# EAGLE schematic cosmicpifpgaOHL (EAGLE 8.3.1)
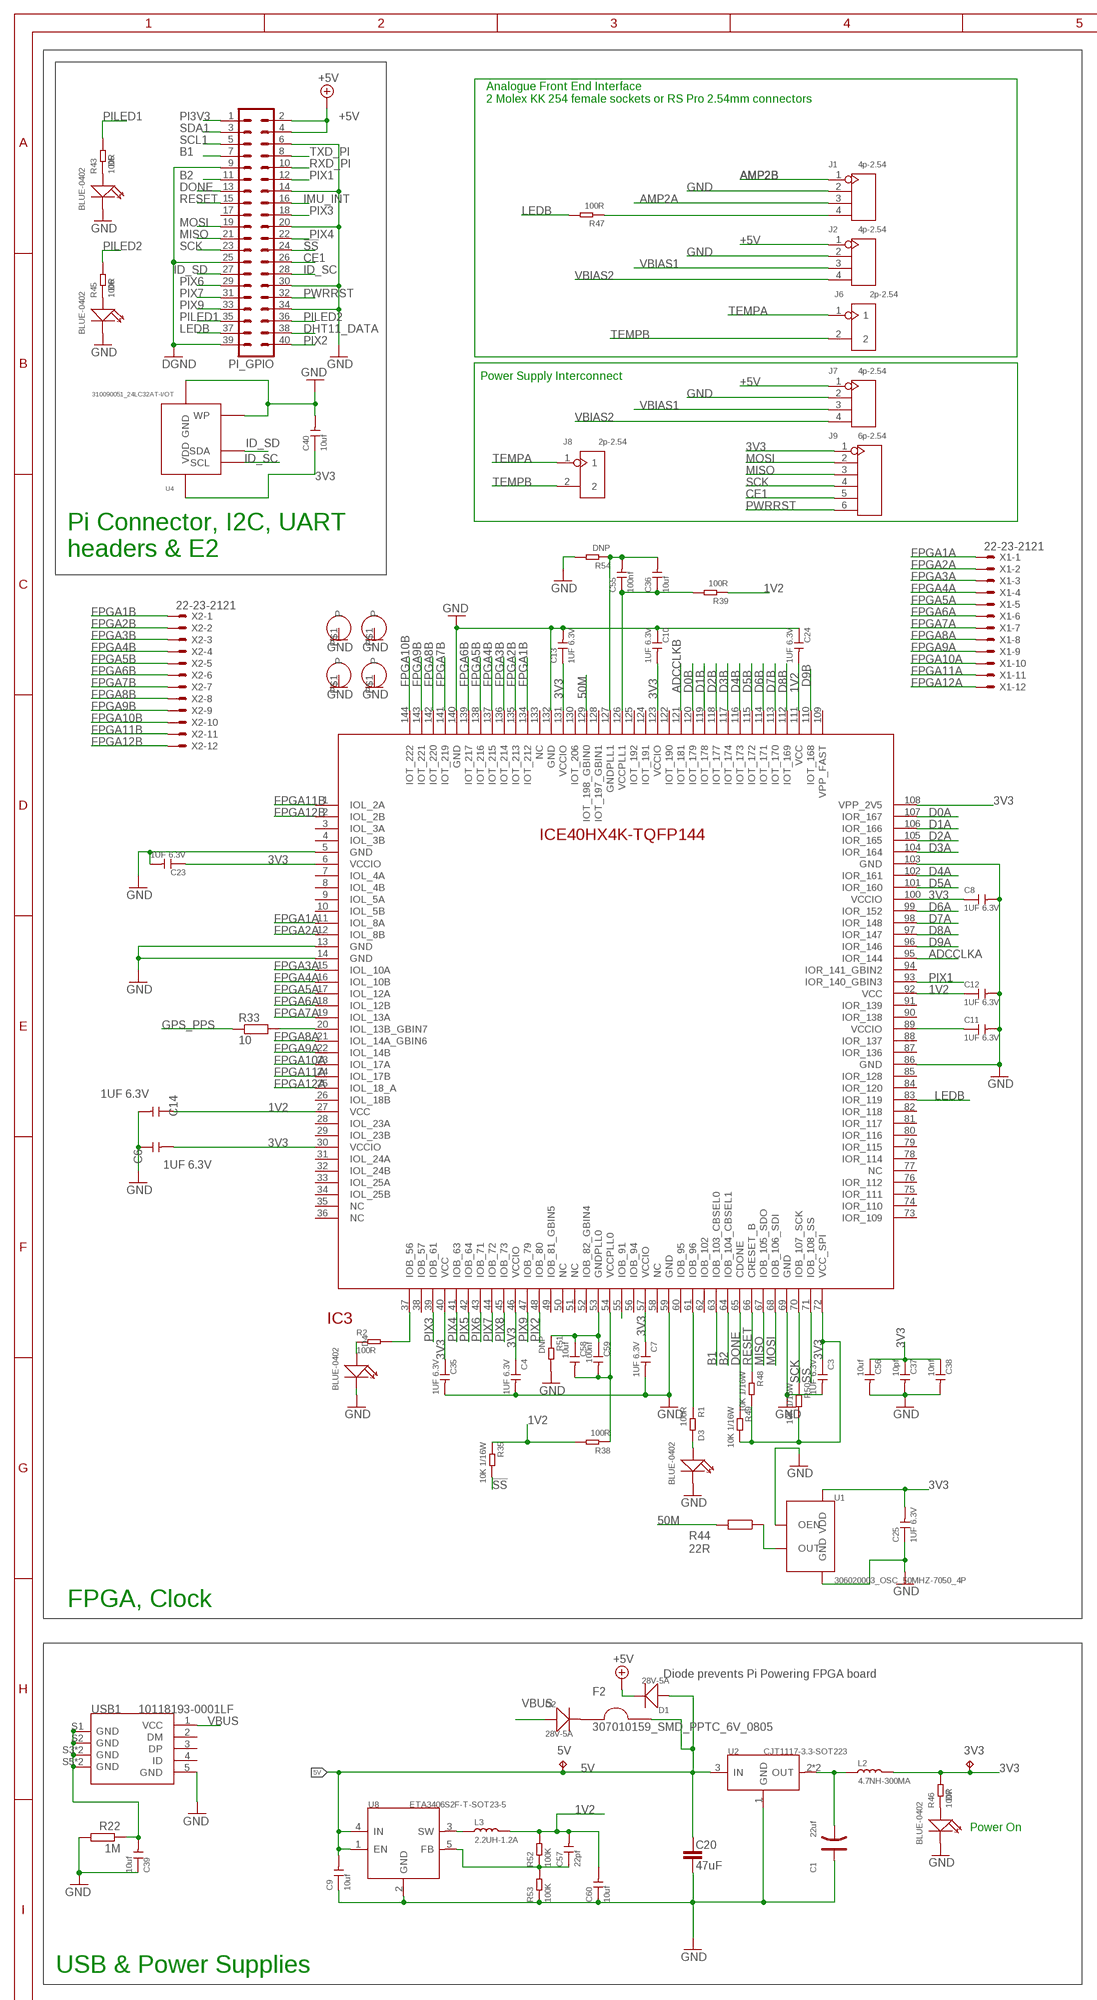
[diagram p0: schematic, sheet 1, part 1 of 2]
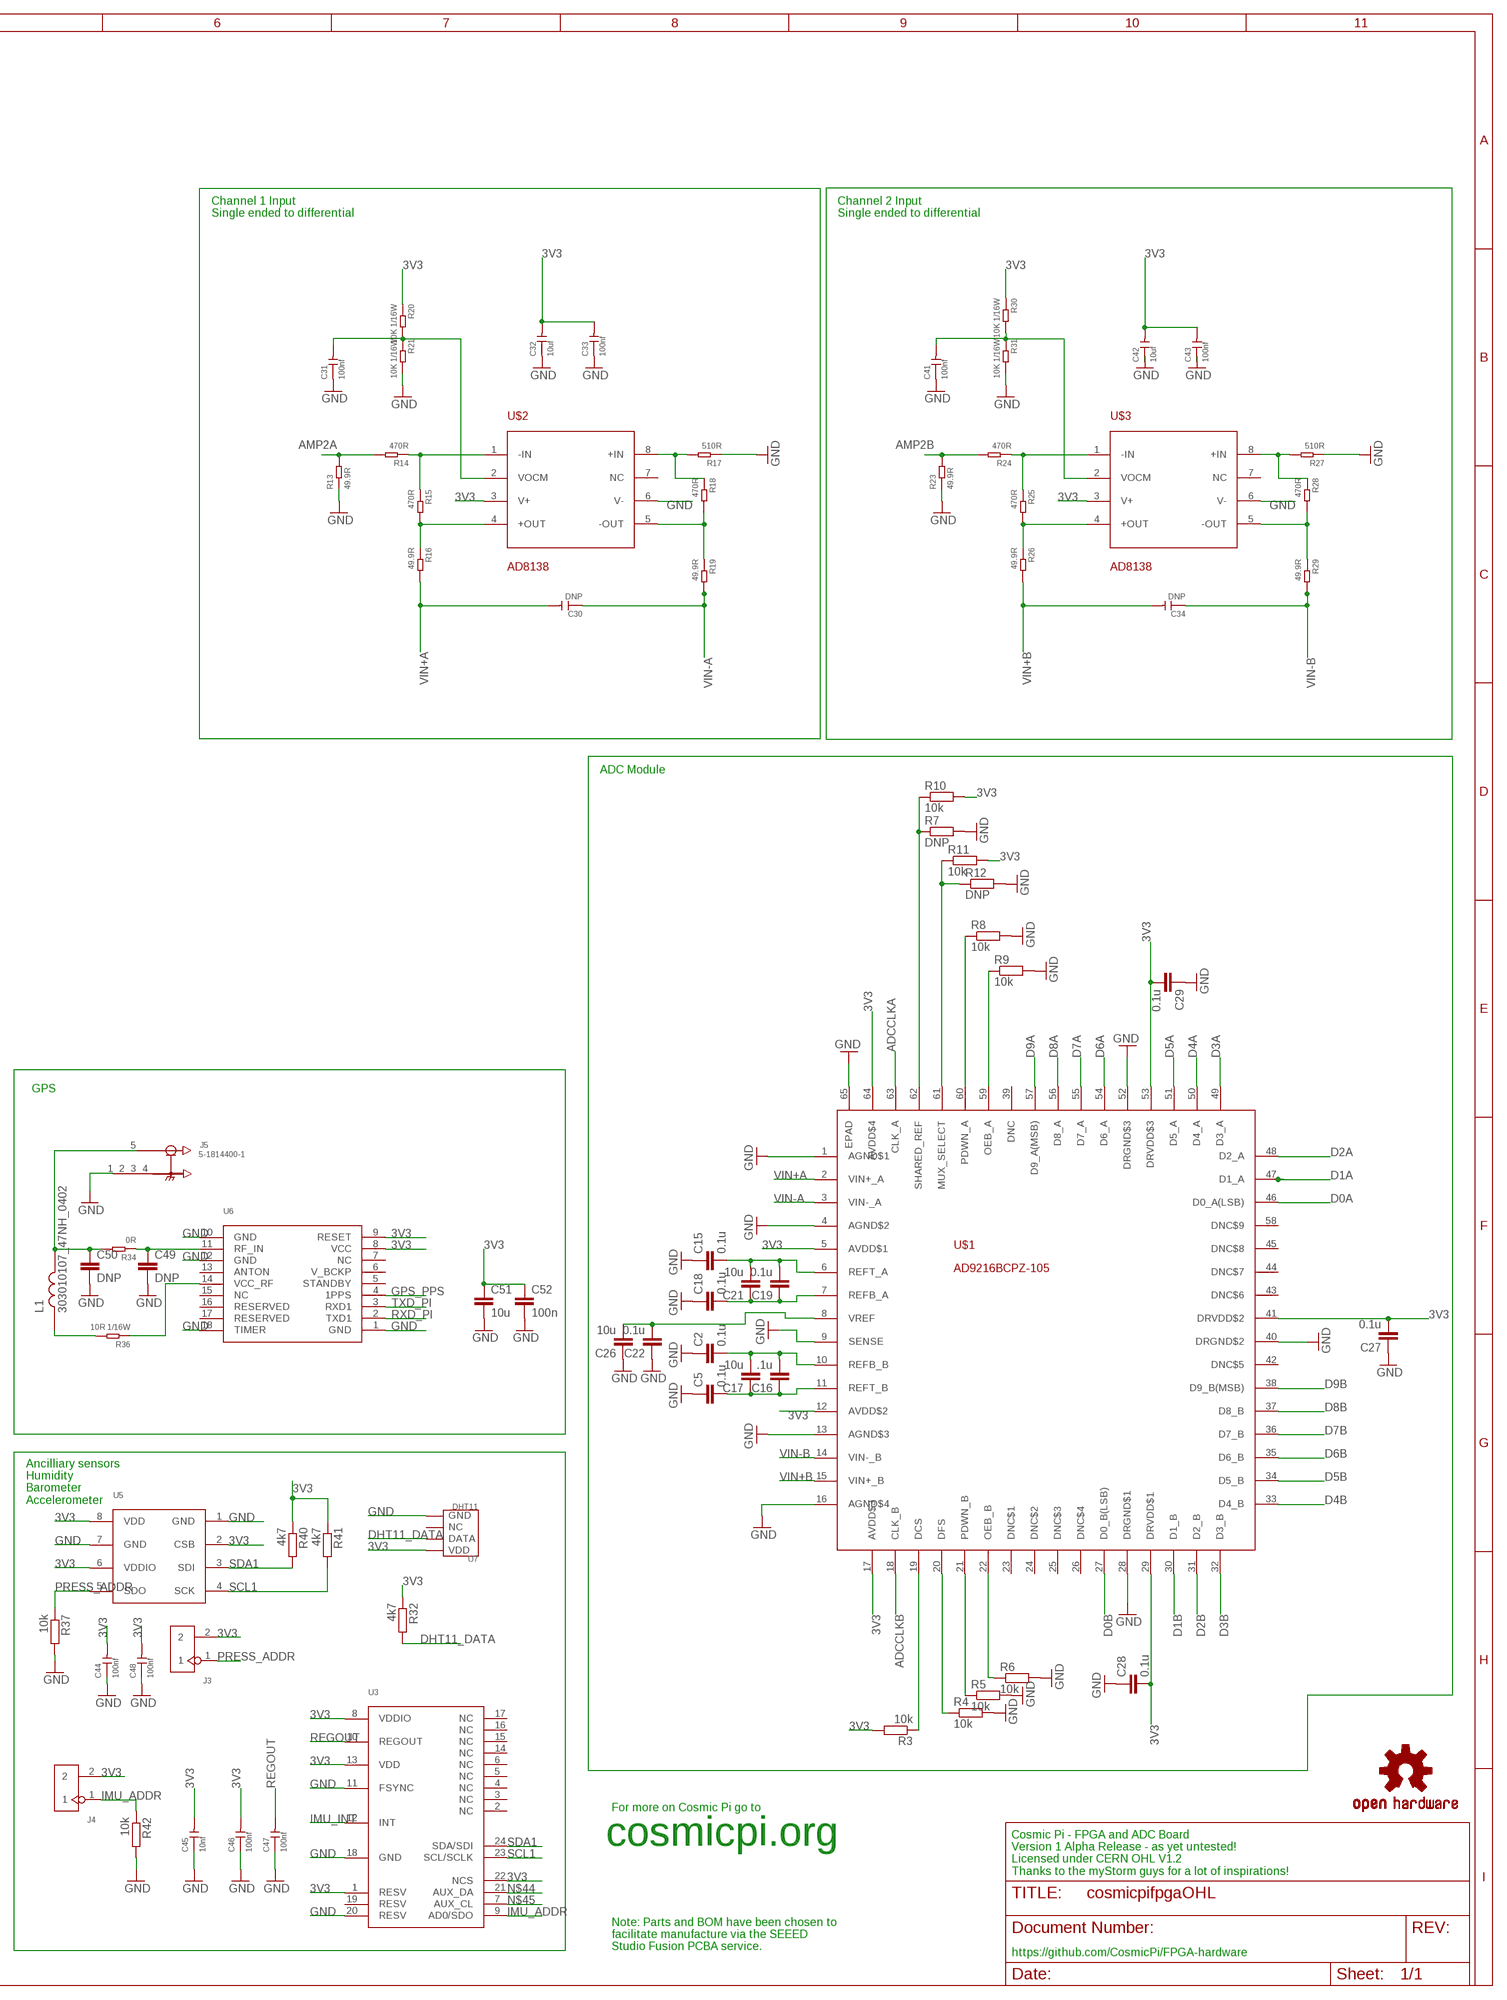
[diagram p1: schematic, sheet 1, part 2 of 2]

## Parts
3V3  TPB1,27  [B1,27]
5V  TPB1,27  [B1,27]
C1  22uf  TANTALUM-SMD-22UF-10V-10%(AVX-B)  [AVX-B]
C2  0.1u  C-EUC0402  [C0402]
C3  1UF 6.3V  CERAMIC-1UF-6.3V-10%-X5R(0402)  [C0402]
C4  1UF 6.3V  CERAMIC-1UF-6.3V-10%-X5R(0402)  [C0402]
C5  0.1u  C-EUC0402  [C0402]
C6  1UF 6.3V  CERAMIC-1UF-6.3V-10%-X5R(0402)  [C0402]
C7  1UF 6.3V  CERAMIC-1UF-6.3V-10%-X5R(0402)  [C0402]
C8  1UF 6.3V  CERAMIC-1UF-6.3V-10%-X5R(0402)  [C0402]
C9  10uf  CERAMIC-10UF-6.3V-20%-X5R(0402)  [C0402]
C10  1UF 6.3V  CERAMIC-1UF-6.3V-10%-X5R(0402)  [C0402]
C11  1UF 6.3V  CERAMIC-1UF-6.3V-10%-X5R(0402)  [C0402]
C12  1UF 6.3V  CERAMIC-1UF-6.3V-10%-X5R(0402)  [C0402]
C13  1UF 6.3V  CERAMIC-1UF-6.3V-10%-X5R(0402)  [C0402]
C14  1UF 6.3V  CERAMIC-1UF-6.3V-10%-X5R(0402)  [C0402]
C15  0.1u  C-EUC0402  [C0402]
C16  .1u  C-EUC0402  [C0402]
C17  10u  C-EUC0402  [C0402]
C18  0.1u  C-EUC0402  [C0402]
C19  0.1u  C-EUC0402  [C0402]
C20  47uF  C_1206  [1206]
C21  10u  C-EUC0402  [C0402]
C22  0.1u  C-EUC0402  [C0402]
C23  1UF 6.3V  CERAMIC-1UF-6.3V-10%-X5R(0402)  [C0402]
C24  1UF 6.3V  CERAMIC-1UF-6.3V-10%-X5R(0402)  [C0402]
C25  1UF 6.3V  CERAMIC-1UF-6.3V-10%-X5R(0402)  [C0402]
C26  10u  C-EUC0402  [C0402]
C27  0.1u  C-EUC0402  [C0402]
C28  0.1u  C-EUC0402  [C0402]
C29  0.1u  C-EUC0402  [C0402]
C30  DNP  CERAMIC-100NF-50V-10%-X7R(0603)  [C0603]
C31  100nf  CERAMIC-100NF-25V-10%-X7R(0402)  [C0402]
C32  10uf  CERAMIC-10UF-6.3V-20%-X5R(0402)  [C0402]
C33  100nf  CERAMIC-100NF-25V-10%-X7R(0402)  [C0402]
C34  DNP  CERAMIC-100NF-50V-10%-X7R(0603)  [C0603]
C35  1UF 6.3V  CERAMIC-1UF-6.3V-10%-X5R(0402)  [C0402]
C36  10uf  CERAMIC-10UF-6.3V-20%-X5R(0402)  [C0402]
C37  10pf  CERAMIC-10PF-50V-5%-NPO(0402)  [C0402]
C38  10nf  CERAMIC-10NF-50V-10%-X7R(0402)  [C0402]
C39  10uf  CERAMIC-10UF-6.3V-20%-X5R(0402)  [C0402]
C40  10uf  CERAMIC-10UF-6.3V-20%-X5R(0402)  [C0402]
C41  100nf  CERAMIC-100NF-25V-10%-X7R(0402)  [C0402]
C42  10uf  CERAMIC-10UF-6.3V-20%-X5R(0402)  [C0402]
C43  100nf  CERAMIC-100NF-25V-10%-X7R(0402)  [C0402]
C44  100nf  CERAMIC-100NF-25V-10%-X7R(0402)  [C0402]
C45  10nf  CERAMIC-10NF-50V-10%-X7R(0402)  [C0402]
C46  100nf  CERAMIC-100NF-25V-10%-X7R(0402)  [C0402]
C47  100nf  CERAMIC-100NF-25V-10%-X7R(0402)  [C0402]
C48  100nf  CERAMIC-100NF-25V-10%-X7R(0402)  [C0402]
C49  DNP  C-EUC0402  [C0402]
C50  DNP  C-EUC0402  [C0402]
C51  10u  C-EUC0402  [C0402]
C52  100n  C-EUC0402  [C0402]
C55  100nf  CERAMIC-100NF-25V-10%-X7R(0402)  [C0402]
C56  10uf  CERAMIC-10UF-6.3V-20%-X5R(0402)  [C0402]
C57  22pf  CERAMIC-22PF-50V-5%-NPO(0402)  [C0402]
C58  10uf  CERAMIC-10UF-6.3V-20%-X5R(0402)  [C0402]
C59  100nf  CERAMIC-100NF-25V-10%-X7R(0402)  [C0402]
C60  10uf  CERAMIC-10UF-6.3V-20%-X5R(0402)  [C0402]
D1  28V-5A  SMD-DIODE-SCHOTTKY-28V-5A(DO-214AA)  [DO-214AA]
D2  28V-5A  SMD-DIODE-SCHOTTKY-28V-5A(DO-214AA)  [DO-214AA]
D3  BLUE-0402  SMD-LED-CLEAR-BLUE(0402)  [LED-0402]
D4  BLUE-0402  SMD-LED-CLEAR-BLUE(0402)  [LED-0402]
D5  BLUE-0402  SMD-LED-CLEAR-BLUE(0402)  [LED-0402]
D6  BLUE-0402  SMD-LED-CLEAR-BLUE(0402)  [LED-0402]
D7  BLUE-0402  SMD-LED-CLEAR-BLUE(0402)  [LED-0402]
F2  307010159_SMD_PPTC_6V_0805  [F0805]
IC3  ICE40HX4K_TQFP144  [TQFP144]
J1  4p-2.54  DIP-BLACK-FEMALE-HEADER-VERT(4P-2.54)  [H4-2.54]
J2  4p-2.54  DIP-BLACK-FEMALE-HEADER-VERT(4P-2.54)  [H4-2.54]
J3  DIP-BLACK-JUMPER  [H2-2.54]
J4  DIP-BLACK-JUMPER  [H2-2.54]
J5  5-1814400-1  [TE_5-1814400-1]
J6  2p-2.54  DIP-BLACK-MALE-HEADER-VERT(2P-2.54)  [H2-2.54]
J7  4p-2.54  DIP-BLACK-FEMALE-HEADER-VERT(4P-2.54)  [H4-2.54]
J8  2p-2.54  DIP-BLACK-MALE-HEADER-VERT(2P-2.54)  [H2-2.54]
J9  6p-2.54  DIP-LONG-BLACK-FEMALE-HEADER-VERT(6P-2.54)  [H6-2.54]
L1  303010107_47NH_0402  [L0402]
L2  4.7NH-300MA  SMD-INDUCTOR-4.7NH-0.3NH-300MA(0402)  [L0402]
L3  2.2UH-1.2A  SMD-INDUCTOR-2.2UH-20%-1.2A(0805)  [L0805]
OSHW  OSHW-LOGOL  [OSHW-LOGO-L]
PI_GPIO  MA20-2  [MA20-2]
R1  100R  SMD-RES-100R-5%-1/16W(0402)  [R0402]
R2  100R  SMD-RES-100R-5%-1/16W(0402)  [R0402]
R3  10k  R-EU_R0402  [R0402]
R4  10k  R-EU_R0402  [R0402]
R5  10k  R-EU_R0402  [R0402]
R6  10k  R-EU_R0402  [R0402]
R7  DNP  R-EU_R0402  [R0402]
R8  10k  R-EU_R0402  [R0402]
R9  10k  R-EU_R0402  [R0402]
R10  10k  R-EU_R0402  [R0402]
R11  10k  R-EU_R0402  [R0402]
R12  DNP  R-EU_R0402  [R0402]
R13  49.9R  SMD-RES-49.9R-1%-1/10W(0603)  [R0603]
R14  470R  SMD-RES-470R-5%-1/10W(0603)  [R0603]
R15  470R  SMD-RES-470R-5%-1/10W(0603)  [R0603]
R16  49.9R  SMD-RES-49.9R-1%-1/10W(0603)  [R0603]
R17  510R  SMD-RES-510R-5%-1/10W(0603)  [R0603]
R18  470R  SMD-RES-470R-5%-1/10W(0603)  [R0603]
R19  49.9R  SMD-RES-49.9R-1%-1/10W(0603)  [R0603]
R20  10K 1/16W  SMD-RES-10K-1%-1/16W(0402)  [R0402]
R21  10K 1/16W  SMD-RES-10K-1%-1/16W(0402)  [R0402]
R22  1M  R-EU_R0402  [R0402]
R23  49.9R  SMD-RES-49.9R-1%-1/10W(0603)  [R0603]
R24  470R  SMD-RES-470R-5%-1/10W(0603)  [R0603]
R25  470R  SMD-RES-470R-5%-1/10W(0603)  [R0603]
R26  49.9R  SMD-RES-49.9R-1%-1/10W(0603)  [R0603]
R27  510R  SMD-RES-510R-5%-1/10W(0603)  [R0603]
R28  470R  SMD-RES-470R-5%-1/10W(0603)  [R0603]
R29  49.9R  SMD-RES-49.9R-1%-1/10W(0603)  [R0603]
R30  10K 1/16W  SMD-RES-10K-1%-1/16W(0402)  [R0402]
R31  10K 1/16W  SMD-RES-10K-1%-1/16W(0402)  [R0402]
R32  4k7  R-EU_R0402  [R0402]
R33  10  R-EU_R0402  [R0402]
R34  0R  SMD-RES-0R-5%-1/16W(0402)  [R0402]
R35  10K 1/16W  SMD-RES-10K-1%-1/16W(0402)  [R0402]
R36  10R 1/16W  SMD-RES-10R-1%-1/16W(0402)  [R0402]
R37  10k  R-EU_R0402  [R0402]
R38  100R  SMD-RES-100R-5%-1/16W(0402)  [R0402]
R39  100R  SMD-RES-100R-5%-1/16W(0402)  [R0402]
R40  4k7  R-EU_R0402  [R0402]
R41  4k7  R-EU_R0402  [R0402]
R42  10k  R-EU_R0402  [R0402]
R43  100R  SMD-RES-100R-5%-1/16W(0402)  [R0402]
R44  22R  R-EU_R0402  [R0402]
R45  100R  SMD-RES-100R-5%-1/16W(0402)  [R0402]
R46  100R  SMD-RES-100R-5%-1/16W(0402)  [R0402]
R47  100R  SMD-RES-100R-5%-1/16W(0402)  [R0402]
R48  10K 1/16W  SMD-RES-10K-1%-1/16W(0402)  [R0402]
R49  10K 1/16W  SMD-RES-10K-1%-1/16W(0402)  [R0402]
R50  10K 1/16W  SMD-RES-10K-1%-1/16W(0402)  [R0402]
R51  DNP  SMD-RES-100R-5%-1/16W(0402)  [R0402]
R52  100K  SMD-RES-100K-1%-1/16W(0402)  [R0402]
R53  100K  SMD-RES-100K-1%-1/16W(0402)  [R0402]
R54  DNP  SMD-RES-100R-5%-1/16W(0402)  [R0402]
U1  306020003_OSC_50MHZ-7050_4P  [X7050_4P]
U2  CJT1117-3.3-SOT223  PMIC-CJT1117-3.3(SOT223)  [SOT-223]
U3  MPU-9250  [MPU-9250]
U4  310090051_24LC32AT-I/OT  [SOT235]
U5  BMP280  [BMP280]
U6  L70-M39  [L70-M39]
U7  DHT11  TEM-HUM-DHT11(4P-15.5X12.0MM)  [SNR4-2.54-15.5X12.0X5.5MM]
U8  ETA3406S2F-T-SOT23-5  PMIC-DC-DC-ETA3406S2F-T(SOT23-5)  [SOT-23-5]
U$1  AD9216BCPZ-105  [QFN50P900X900X100-65N]
U$2  AD8138  [SOP65P490X110-8N]
U$3  AD8138  [SOP65P490X110-8N]
U$16  HOLE-2.5MM  [2.5MM-HOLE]
U$21  HOLE-2.5MM  [2.5MM-HOLE]
U$22  HOLE-2.5MM  [2.5MM-HOLE]
U$24  HOLE-2.5MM  [2.5MM-HOLE]
USB1  10118193-0001LF  MICRO-USB-SMD-B-(10118193-0001LF)  [MICRO-USB5+6P-SMD-0.65-B]
X1  22-23-2121  [22-23-2121]
X2  22-23-2121  [22-23-2121]

## Nets
1V2: C12.1 C14.1 C24.2 C57.2 C60.2 IC3.27(VCC) IC3.92(VCC) IC3.111(VCC) L3.2 R35.1 R38.2 R39.1 R52.2
3V3: 3V3.TP C3.1 C4.1 C6.2 C7.1 C8.1 C10.2 C13.1 C23.1 C25.2 C27.2 C28.2 C29.2 C32.2 C33.2 C35.1 C37.1 C38.1 C40.1 C42.2 C43.2 C44.2 C45.2 C46.2 C48.2 C51.1 C52.1 C56.1 IC3.6(VCCIO) IC3.30(VCCIO) IC3.40(VCC) IC3.46(VCCIO) IC3.57(VCCIO) IC3.72(VCC_SPI) IC3.100(VCCIO) IC3.108(VPP_2V5) IC3.123(VCCIO) IC3.131(VCCIO) J3.2 J4.2 J9.1 L2.2 R3.2 R10.2 R11.2 R20.1 R30.1 R32.1 R40.1 R41.1 R46.2 R48.2 R49.2 R50.2 U1.P$4(VDD) U3.1(RESV) U3.8(VDDIO) U3.13(VDD) U3.22(NCS) U4.4(VDD) U5.2(CSB) U5.6(VDDIO) U5.8(VDD) U6.8(VCC) U6.9(RESET) U7.1(VDD) U$1.5(AVDD$1) U$1.12(AVDD$2) U$1.17(AVDD$3) U$1.29(DRVDD$1) U$1.41(DRVDD$2) U$1.53(DRVDD$3) U$1.64(AVDD$4) U$2.3(V+) U$3.3(V+)
5V: 5V.TP C9.2 C20.1 D1.+ F2.P$2 U2.3(IN) U8.1(EN) U8.4(IN)
50M: IC3.129(IOT_198_GBIN0) R44.2
!SS: IC3.71(IOB_108_SS) PI_GPIO.24 R35.2
+5V: D1.- J2.1 J7.1 PI_GPIO.2 PI_GPIO.4
ADCCLKA: IC3.95(IOR_144) U$1.63(CLK_A)
ADCCLKB: IC3.121(IOT_181) U$1.18(CLK_B)
AMP2A [timing]: J1.3 R13.2 R14.2
AMP2B [timing]: J1.1 R23.2 R24.2
B1: IC3.63(IOB_103_CBSEL0) PI_GPIO.7
B2: IC3.64(IOB_104_CBSEL1) PI_GPIO.11
CE1: J9.5 PI_GPIO.26
D0A: IC3.107(IOR_167) U$1.46(D0_A(LSB))
D0B: IC3.120(IOT_179) U$1.27(D0_B(LSB))
D1A: IC3.106(IOR_166) U$1.47(D1_A)
D1B: IC3.119(IOT_178) U$1.30(D1_B)
D2A: IC3.105(IOR_165) U$1.48(D2_A)
D2B: IC3.118(IOT_177) U$1.31(D2_B)
D3A: IC3.104(IOR_164) U$1.49(D3_A)
D3B: IC3.117(IOT_174) U$1.32(D3_B)
D4A: IC3.102(IOR_161) U$1.50(D4_A)
D4B: IC3.116(IOT_173) U$1.33(D4_B)
D5A: IC3.101(IOR_160) U$1.51(D5_A)
D5B: IC3.115(IOT_172) U$1.34(D5_B)
D6A: IC3.99(IOR_152) U$1.54(D6_A)
D6B: IC3.114(IOT_171) U$1.35(D6_B)
D7A: IC3.98(IOR_148) U$1.55(D7_A)
D7B: IC3.113(IOT_170) U$1.36(D7_B)
D8A: IC3.97(IOR_147) U$1.56(D8_A)
D8B: IC3.112(IOT_169) U$1.37(D8_B)
D9A: IC3.96(IOR_146) U$1.57(D9_A(MSB))
D9B: IC3.110(IOT_168) U$1.38(D9_B(MSB))
DHT11_DATA: PI_GPIO.38 R32.2 U7.2(DATA)
DONE: IC3.65(CDONE) PI_GPIO.13 R49.1
FPGA1A: IC3.11(IOL_8A) X1.1
FPGA1B: IC3.134(IOT_212) X2.1
FPGA2A: IC3.12(IOL_8B) X1.2
FPGA2B: IC3.135(IOT_213) X2.2
FPGA3A: IC3.15(IOL_10A) X1.3
FPGA3B: IC3.136(IOT_214) X2.3
FPGA4A: IC3.16(IOL_10B) X1.4
FPGA4B: IC3.137(IOT_215) X2.4
FPGA5A: IC3.17(IOL_12A) X1.5
FPGA5B: IC3.138(IOT_216) X2.5
FPGA6A: IC3.18(IOL_12B) X1.6
FPGA6B: IC3.139(IOT_217) X2.6
FPGA7A: IC3.19(IOL_13A) X1.7
FPGA7B: IC3.141(IOT_219) X2.7
FPGA8A: IC3.21(IOL_14A_GBIN6) X1.8
FPGA8B: IC3.142(IOT_220) X2.8
FPGA9A: IC3.22(IOL_14B) X1.9
FPGA9B: IC3.143(IOT_221) X2.9
FPGA10A: IC3.23(IOL_17A) X1.10
FPGA10B: IC3.144(IOT_222) X2.10
FPGA11A: IC3.24(IOL_17B) X1.11
FPGA11B: IC3.1(IOL_2A) X2.11
FPGA12A: IC3.25(IOL_18_A) X1.12
FPGA12B: IC3.2(IOL_2B) X2.12
GND: C1.+ C2.1 C3.2 C4.2 C5.1 C6.1 C7.2 C8.2 C9.1 C10.1 C11.2 C12.2 C13.2 C14.2 C15.1 C18.1 C20.2 C22.1 C23.2 C24.1 C25.1 C26.1 C27.1 C28.1 C29.1 C31.1 C32.1 C33.1 C35.2 C37.2 C38.2 C39.1 C40.2 C41.1 C42.1 C43.1 C44.1 C45.1 C46.1 C47.1 C48.1 C49.2 C50.2 C51.2 C52.2 C56.2 C60.1 D3.- D4.- D5.- D6.- D7.- IC3.5(GND) IC3.13(GND) IC3.14(GND) IC3.59(GND) IC3.69(GND) IC3.86(GND) IC3.103(GND) IC3.132(GND) IC3.140(GND) J1.2 J2.2 J5.1(GND) J7.2 PI_GPIO.6 PI_GPIO.9 PI_GPIO.14 PI_GPIO.20 PI_GPIO.25 PI_GPIO.30 PI_GPIO.34 PI_GPIO.39 R4.2 R5.2 R6.2 R7.2 R8.2 R9.2 R12.2 R13.1 R17.1 R21.2 R22.2 R23.1 R27.1 R31.2 R37.2 R42.2 R51.2 R53.1 R54.2 U1.P$1(OEN) U1.P$2(GND) U2.1(GND) U3.11(FSYNC) U3.18(GND) U3.20(RESV) U4.2(GND) U4.5(WP) U5.1(GND) U5.7(GND) U6.1(GND) U6.10(GND) U6.12(GND) U6.18(TIMER) U7.4(GND) U8.2(GND) U$1.1(AGND$1) U$1.4(AGND$2) U$1.9(SENSE) U$1.13(AGND$3) U$1.16(AGND$4) U$1.28(DRGND$1) U$1.40(DRGND$2) U$1.52(DRGND$3) U$1.65(EPAD) U$2.6(V-) U$3.6(V-) U$16.P$1(P) U$21.P$1(P) U$22.P$1(P) U$24.P$1(P) USB1.5(GND) ; supply symbol labelled DGND
GPS_PPS: R33.1 U6.4(1PPS)
ID_SC: PI_GPIO.28 U4.1(SCL)
ID_SD: PI_GPIO.27 U4.3(SDA)
IMU_ADDR: J4.1 R42.1 U3.9(AD0/SDO)
IMU_INT: PI_GPIO.16 U3.12(INT)
LEDB: IC3.83(IOR_119) PI_GPIO.37 R47.2
MISO: IC3.67(IOB_105_SDO) J9.3 PI_GPIO.21
MOSI: IC3.68(IOB_106_SDI) J9.2 PI_GPIO.19
N$1: C2.2 C16.2 C17.2 U$1.10(REFB_B)
N$3: C36.1 C55.1 IC3.126(VCCPLL1) R39.2
N$4: C39.2 R22.1 USB1.S1(GND) USB1.S2(GND) USB1.S3(GND) USB1.S4(GND) USB1.S5(GND) USB1.S6(GND)
N$5: D3.+ R1.2
N$6: C5.2 C16.1 C17.1 U$1.11(REFT_B)
N$7: C15.2 C19.2 C21.2 U$1.6(REFT_A)
N$8: R44.1 U1.P$3(OUT)
N$9: D2.- F2.P$1
N$10: C18.2 C19.1 C21.1 U$1.7(REFB_A)
N$11: R6.1 U$1.22(OEB_B)
N$12: IC3.37(IOB_56) R2.2
N$13: D4.+ R2.1
N$14: C22.2 C26.2 U$1.8(VREF)
N$15: R5.1 U$1.21(PDWN_B)
N$16: R4.1 U$1.20(DFS)
N$17: R3.1 U$1.19(DCS)
N$18: C58.2 C59.2 IC3.54(VCCPLL0) R38.1
N$19: IC3.20(IOL_13B_GBIN7) R33.2
N$20: IC3.61(IOB_96) R1.1
N$22: R7.1 R10.1 U$1.62(SHARED_REF)
N$23: R11.1 R12.1 U$1.61(MUX_SELECT)
N$24: R8.1 U$1.60(PDWN_A)
N$25: R9.1 U$1.59(OEB_A)
N$26: R14.1 R15.1 U$2.1(-IN)
N$27: C1.- L2.1 U2.2(OUT) U2.TER(OUT)
N$29: R15.2 R16.1 U$2.4(+OUT)
N$30: C11.1 IC3.89(VCCIO)
N$31: C31.2 R20.2 R21.1 U$2.2(VOCM)
N$32: R17.2 R18.1 U$2.8(+IN)
N$34: R18.2 R19.1 U$2.5(-OUT)
N$38: R24.1 R25.1 U$3.1(-IN)
N$39: R25.2 R26.1 U$3.4(+OUT)
N$40: C41.2 R30.2 R31.1 U$3.2(VOCM)
N$41: R27.2 R28.1 U$3.8(+IN)
N$42: R28.2 R29.1 U$3.5(-OUT)
N$44: U3.21(AUX_DA)
N$45: U3.7(AUX_CL)
N$49: D5.+ R43.1
N$50: D6.+ R45.1
N$51: D7.+ R46.1
N$52: J1.4 R47.1
N$54: C58.1 C59.1 IC3.53(GNDPLL0) R51.1
N$55: C36.2 C55.2 IC3.127(GNDPLL1) R54.1
N$58: L3.1 U8.3(SW)
N$61: C57.1 R52.1 R53.2 U8.5(FB)
PI3V3: PI_GPIO.1
PILED1: PI_GPIO.35 R43.2
PILED2: PI_GPIO.36 R45.2
PIX1: IC3.93(IOR_140_GBIN3) PI_GPIO.12
PIX2: IC3.48(IOB_80) PI_GPIO.40
PIX3: IC3.39(IOB_61) PI_GPIO.18
PIX4: IC3.41(IOB_63) PI_GPIO.22
PIX5: IC3.42(IOB_64)
PIX6: IC3.43(IOB_71) PI_GPIO.29
PIX7: IC3.44(IOB_72) PI_GPIO.31
PIX8: IC3.45(IOB_73)
PIX9: IC3.47(IOB_79) PI_GPIO.33
PIX13: IC3.55(IOB_91)
PRESS_ADDR: J3.1 R37.1 U5.5(SDO)
PWRRST: J9.6 PI_GPIO.32
REGOUT: C47.2 U3.10(REGOUT)
RESET: IC3.66(CRESET_B) PI_GPIO.15 R48.1
RF_IN: C49.1 R34.1 U6.11(RF_IN)
RF_IN2: C50.1 J5.5(SIG) L1.P$2 R34.2
RXD_PI: PI_GPIO.10 U6.2(TXD1)
SCK: IC3.70(IOB_107_SCK) J9.4 PI_GPIO.23 R50.1
SCL1: PI_GPIO.5 R41.2 U3.23(SCL/SCLK) U5.4(SCK)
SDA1: PI_GPIO.3 R40.2 U3.24(SDA/SDI) U5.3(SDI)
TEMPA: J6.1 J8.1
TEMPB: J6.2 J8.2
TXD_PI: PI_GPIO.8 U6.3(RXD1)
VBIAS1 [Vbias]: J2.3 J7.3
VBIAS2 [Vbias]: J2.4 J7.4
VBUS: D2.+ USB1.1(VCC)
VCC_RF: R36.1 U6.14(VCC_RF)
VCC_RF2: L1.P$1 R36.2
VIN+A: C30.2 R16.2 U$1.2(VIN+_A)
VIN+B: C34.2 R26.2 U$1.15(VIN+_B)
VIN-A: C30.1 R19.2 U$1.3(VIN-_A)
VIN-B: C34.1 R29.2 U$1.14(VIN-_B)
Unconnected: IC3.3(IOL_3A) IC3.4(IOL_3B) IC3.7(IOL_4A) IC3.8(IOL_4B) IC3.9(IOL_5A) IC3.10(IOL_5B) IC3.26(IOL_18B) IC3.28(IOL_23A) IC3.29(IOL_23B) IC3.31(IOL_24A) IC3.32(IOL_24B) IC3.33(IOL_25A) IC3.34(IOL_25B) IC3.35(NC) IC3.36(NC) IC3.38(IOB_57) IC3.49(IOB_81_GBIN5) IC3.50(NC) IC3.51(NC) IC3.52(IOB_82_GBIN4) IC3.56(IOB_94) IC3.58(NC) IC3.60(IOB_95) IC3.62(IOB_102) IC3.73(IOR_109) IC3.74(IOR_110) IC3.75(IOR_111) IC3.76(IOR_112) IC3.77(NC) IC3.78(IOR_114) IC3.79(IOR_115) IC3.80(IOR_116) IC3.81(IOR_117) IC3.82(IOR_118) IC3.84(IOR_120) IC3.85(IOR_128) IC3.87(IOR_136) IC3.88(IOR_137) IC3.90(IOR_138) IC3.91(IOR_139) IC3.94(IOR_141_GBIN2) IC3.109(VPP_FAST) IC3.122(IOT_190) IC3.124(IOT_191) IC3.125(IOT_192) IC3.128(IOT_197_GBIN1) IC3.130(IOT_206) IC3.133(NC) J5.2(GND) J5.3(GND) J5.4(GND) PI_GPIO.17 U3.2(NC) U3.3(NC) U3.4(NC) U3.5(NC) U3.6(NC) U3.14(NC) U3.15(NC) U3.16(NC) U3.17(NC) U3.19(RESV) U6.5(STANDBY) U6.6(V_BCKP) U6.7(NC) U6.13(ANTON) U6.15(NC) U6.16(RESERVED) U6.17(RESERVED) U7.3(NC) U$1.23(DNC$1) U$1.24(DNC$2) U$1.25(DNC$3) U$1.26(DNC$4) U$1.39(DNC) U$1.42(DNC$5) U$1.43(DNC$6) U$1.44(DNC$7) U$1.45(DNC$8) U$1.58(DNC$9) U$2.7(NC) U$3.7(NC) USB1.2(DM) USB1.3(DP) USB1.4(ID)

## Notes on the sheet
- Analogue Front End Interface
  2 Molex KK 254 female sockets or RS Pro 2.54mm connectors
- Channel 1 Input
  Single ended to differential
- Channel 2 Input
  Single ended to differential
- Power Supply Interconnect
- Pi Connector, I2C, UART
  headers & E2
- ADC Module
- GPS
- Ancilliary sensors
  Humidity
  Barometer
  Accelerometer
- FPGA, Clock
- Diode prevents Pi Powering FPGA board
- Power On
- For more on Cosmic Pi go to
- cosmicpi.org
- Cosmic Pi - FPGA and ADC Board
  Version 1 Alpha Release - as yet untested!
  Licensed under CERN OHL V1.2
  Thanks to the myStorm guys for a lot of inspirations!
- USB & Power Supplies
- Note: Parts and BOM have been chosen to
  facilitate manufacture via the SEEED
  Studio Fusion PCBA service.
- https://github.com/CosmicPi/FPGA-hardware

## Library data of the parts
3V3 5V = testpad:TP: Test pad
C1 = Seeed-Capacitor:TANTALUM-SMD-22UF-10V-10%(AVX-B): 302020021; MPN: TAJB226K010RNJ
C2 C5 C15-C19 C21 C22 C26-C29 C49-C52 = rcl:C-EU: CAPACITOR, European symbol
C3 C4 C6-C8 C10-C14 C23-C25 C35 = Seeed-Capacitor:CERAMIC-1UF-6.3V-10%-X5R(0402): 302010003; MPN: CC0402KRX5R5BB105
C9 C32 C36 C39 C40 C42 C56 C58 C60 = Seeed-Capacitor:CERAMIC-10UF-6.3V-20%-X5R(0402): 302010053; MPN: CC0402MRX5R5BB106
C20 = C:C
C30 C34 = Seeed-Capacitor:CERAMIC-100NF-50V-10%-X7R(0603): 302010138; MPN: CC0603KRX7R9BB104; VALUE: 100nf
C31 C33 C41 C43 C44 C46-C48 C55 C59 = Seeed-Capacitor:CERAMIC-100NF-25V-10%-X7R(0402): 302010024; MPN: CC0402KRX7R8BB104
C37 = Seeed-Capacitor:CERAMIC-10PF-50V-5%-NPO(0402): 302010001; MPN: CC0402JRNPO9BN100
C38 C45 = Seeed-Capacitor:CERAMIC-10NF-50V-10%-X7R(0402): 302010006; MPN: CC0402KRX7R9BB103
C57 = Seeed-Capacitor:CERAMIC-22PF-50V-5%-NPO(0402): 302010018; MPN: CC0402JRNPO9BN220
D1 D2 = Seeed-Diode:SMD-DIODE-SCHOTTKY-28V-5A(DO-214AA): 304020021; MPN: SS54B
D3-D7 = Seeed-LED:SMD-LED-CLEAR-BLUE(0402): 304090075; MPN: BL-HB337A-AV-TRB
F2 = Seeed-OPL-2017-01-Fuse-Akita:307010159_SMD_PPTC_6V_0805: SMD PPTC;6V-1.1A;0805, Littelfuse Inc.;0805L110SLYR, SKU: 307010159
IC3 = ICE40:ICE40HX4K_TQFP144
J1 J2 J7 = Seeed-Connector:DIP-BLACK-FEMALE-HEADER-VERT(4P-2.54): 320030017; MPN: F185-1104A1BSYA1
J3 J4 = Seeed-Connector:DIP-BLACK-JUMPER: 320190003
J5 = 5-1814400-1:5-1814400-1: Conn SMA RCP 0Hz to 3GHz 50Ohm Solder RA Thru-Hole Gold Over Nickel Over Copper
J6 J8 = Seeed-Connector:DIP-BLACK-MALE-HEADER-VERT(2P-2.54): 320020016; MPN: P125-1102A0BS116A1
J9 = Seeed-Connector:DIP-LONG-BLACK-FEMALE-HEADER-VERT(6P-2.54): 320030012; MPN: F185-1106A1BSYA2
L1 = Seeed-OPL-2017-01-Inductor-Akita:303010107_47NH_0402: Murata;LQW15AN47NJ00D, SMD Inductor;47nH-5%-210mA-0402, SKU: 303010107
L2 = Seeed-Inductor:SMD-INDUCTOR-4.7NH-0.3NH-300MA(0402): 303010037; MPN: LQG15HS4N7S02
L3 = Seeed-Inductor:SMD-INDUCTOR-2.2UH-20%-1.2A(0805): 303010086; MPN: LQM2MPN2R2MG0
OSHW = SparkFun:OSHW-LOGO: Open Source Hardware Logo This logo indicates the piece of hardware it is found on incorporates a OSHW license and/or adheres to the definition of open source hardware found here: http://freedomdefined.org/OSHW
PI_GPIO = con-lstb:MA20-2: PIN HEADER; OC_FARNELL: unknown; OC_NEWARK: unknown
R1 R2 R38 R39 R43 R45-R47 = Seeed-Resistor:SMD-RES-100R-5%-1/16W(0402): 301010028; MPN: RC0402JR-07100RL
R3-R12 R22 R32 R33 R37 R40-R42 R44 = resistor:R-EU_: RESISTOR, European symbol
R13 R16 R19 R23 R26 R29 = Seeed-Resistor:SMD-RES-49.9R-1%-1/10W(0603): 301010296; MPN: RC0603FR-0749R9L
R14 R15 R18 R24 R25 R28 = Seeed-Resistor:SMD-RES-470R-5%-1/10W(0603): 301010088; MPN: RC0603JR-07470RL
R17 R27 = Seeed-Resistor:SMD-RES-510R-5%-1/10W(0603): 301010157; MPN: RC0603JR-07510RL
R20 R21 R30 R31 R35 R48-R50 = Seeed-Resistor:SMD-RES-10K-1%-1/16W(0402): 301010047; MPN: RC0402FR-0710KL
R34 = Seeed-Resistor:SMD-RES-0R-5%-1/16W(0402): 301010000; MPN: RC0402JR-070RL
R36 = Seeed-Resistor:SMD-RES-10R-1%-1/16W(0402): 301010444; MPN: RC0402FR-0710RL
R51 R54 = Seeed-Resistor:SMD-RES-100R-5%-1/16W(0402): 301010028; MPN: RC0402JR-07100RL; VALUE: 100R
R52 R53 = Seeed-Resistor:SMD-RES-100K-1%-1/16W(0402): 301010456; MPN: RC0402FR-07100KL
U1 = Seeed-OPL-2017-01-Crystal-Akita:306020003_OSC_50MHZ-7050_4P: SMD Oscillator 50MHz-3.3V;4P-SMD-L7.0*W5.0mm, SKU: 306020003
U2 = Seeed-IC:PMIC-CJT1117-3.3(SOT223): 310030097; MPN: CJT1117-3.3
U3 = Seeed-OPL-2017-01-Sensor-camilo:MPU-9250: 314990005
U4 = Seeed-OPL-2017-01-IC-Akita:310090051_24LC32AT-I/OT: Microchip;24LC32AT-I/OT, SMD IC Memory;SOT-23-5, SKU: 310090051
U5 = Seeed-OPL-2017-01-Sensor-camilo:BMP280: 314030010
U6 = Seeed-OPL-2017-01-Sensor-camilo:L70-M39: 317050012
U7 = Seeed-Sensor:TEM-HUM-DHT11(4P-15.5X12.0MM): 314010000; MPN: DHT11
U8 = Seeed-IC:PMIC-DC-DC-ETA3406S2F-T(SOT23-5): 310030148; MPN: ETA3406S2F-T
U$1 = omnivision:AD9216BCPZ-105
U$2 U$3 = omnivision:AD8138
U$16 U$21 U$22 U$24 = amino:HOLE-2.5MM
USB1 = Seeed-Connector:MICRO-USB-SMD-B-(10118193-0001LF): 320010003; MPN: 10118193-0001LF
X1 X2 = con-molex:22-23-2121: .100" (2.54mm) Center Header - 12 Pin; MF: MOLEX; MPN: 22-23-2121; OC_FARNELL: 1462935; OC_NEWARK: 56H0456

## Net classes
0 default: width 0.152 mm, clearance 0.152 mm
1 power: width 0.152 mm, clearance 0.152 mm
2 thin_power: width 0.152 mm, clearance 0.152 mm
3 timing: width 0.152 mm, drill 0.406 mm, clearance 0.152 mm to class 0, clearance 0.152 mm to class 1, clearance 0.152 mm to class 2, clearance 0.152 mm
5 PSU: width 0.152 mm, drill 0.406 mm, clearance 0.152 mm to class 0, clearance 0.152 mm to class 1, clearance 0.152 mm to class 2, clearance 0.152 mm to class 3, clearance 0.152 mm to class 4, clearance 0.152 mm
6 Vbias: width 0.152 mm, drill 0.406 mm, clearance 0.254 mm to class 0, clearance 0.254 mm to class 1, clearance 0.254 mm to class 2, clearance 0.254 mm to class 3, clearance 0.254 mm to class 4, clearance 0.254 mm to class 5, clearance 0.356 mm